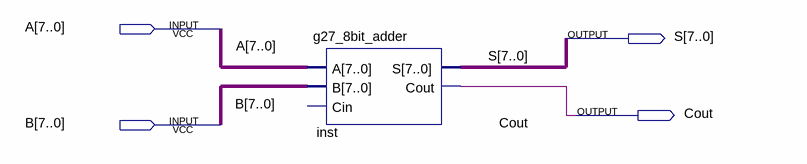
[diagram p0: schematic sheet]
// Quartus schematic g27_8bit_adder_lab.bdf as structural Verilog: 1 symbols, 4 pins
module g27_8bit_adder_lab (
  input  [7:0] A,
  input  [7:0] B,
  output [7:0] S,
  output Cout
);

  g27_8bit_adder inst (.A(A), .B(B), .S(S), .Cout(Cout));  // open: Cin
endmodule
